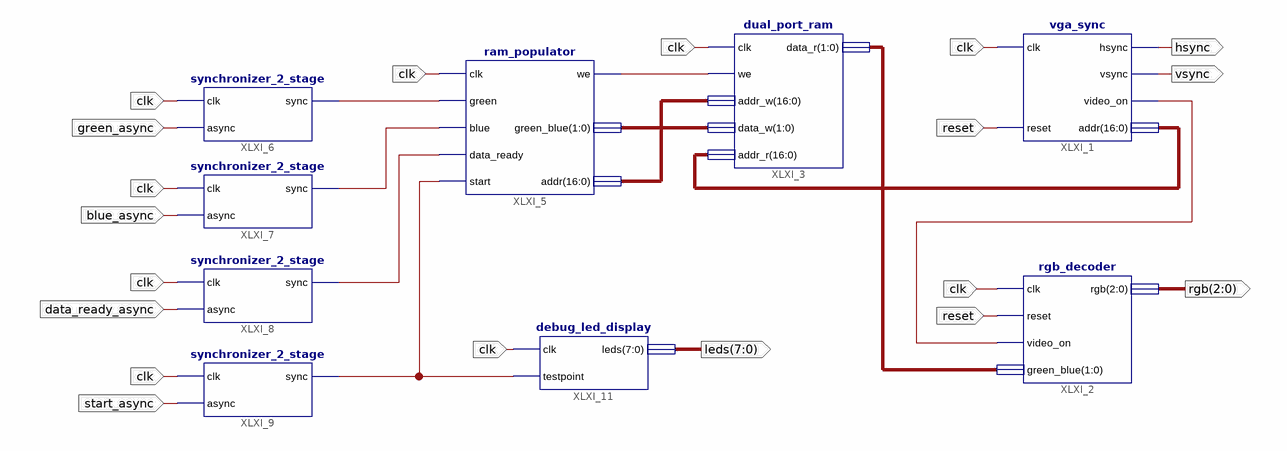
[diagram p0: schematic sheet 1]
// Xilinx ISE schematic video_card.sch (spartan3e) as structural Verilog: 9 symbols, 10 ports
module video_card (
  input  clk,
  input  reset,
  input  green_async,
  input  blue_async,
  input  start_async,
  input  data_ready_async,
  output hsync,
  output vsync,
  output [2:0] rgb,
  output [7:0] leds
);

  wire XLXN_11, XLXN_14, XLXN_21, XLXN_22, XLXN_23, XLXN_24;
  wire [1:0] XLXN_13, XLXN_16;
  wire [16:0] XLXN_6, XLXN_15;

  vga_sync XLXI_1 (.clk(clk), .reset(reset), .hsync(hsync), .vsync(vsync), .video_on(XLXN_11), .addr(XLXN_6));
  rgb_decoder XLXI_2 (.clk(clk), .reset(reset), .video_on(XLXN_11), .green_blue(XLXN_13), .rgb(rgb));
  dual_port_ram XLXI_3 (.clk(clk), .we(XLXN_14), .addr_w(XLXN_15), .data_w(XLXN_16), .addr_r(XLXN_6), .data_r(XLXN_13));
  ram_populator XLXI_5 (
    .clk(clk), .green(XLXN_21), .blue(XLXN_22), .data_ready(XLXN_23), .start(XLXN_24), .we(XLXN_14),
    .green_blue(XLXN_16), .addr(XLXN_15));
  synchronizer_2_stage XLXI_6 (.clk(clk), .async(green_async), .sync(XLXN_21));
  synchronizer_2_stage XLXI_7 (.clk(clk), .async(blue_async), .sync(XLXN_22));
  synchronizer_2_stage XLXI_8 (.clk(clk), .async(data_ready_async), .sync(XLXN_23));
  synchronizer_2_stage XLXI_9 (.clk(clk), .async(start_async), .sync(XLXN_24));
  debug_led_display XLXI_11 (.clk(clk), .testpoint(XLXN_24), .leds(leds));
endmodule
